# Altium schematic sheet Sheet2.SchDoc
size A
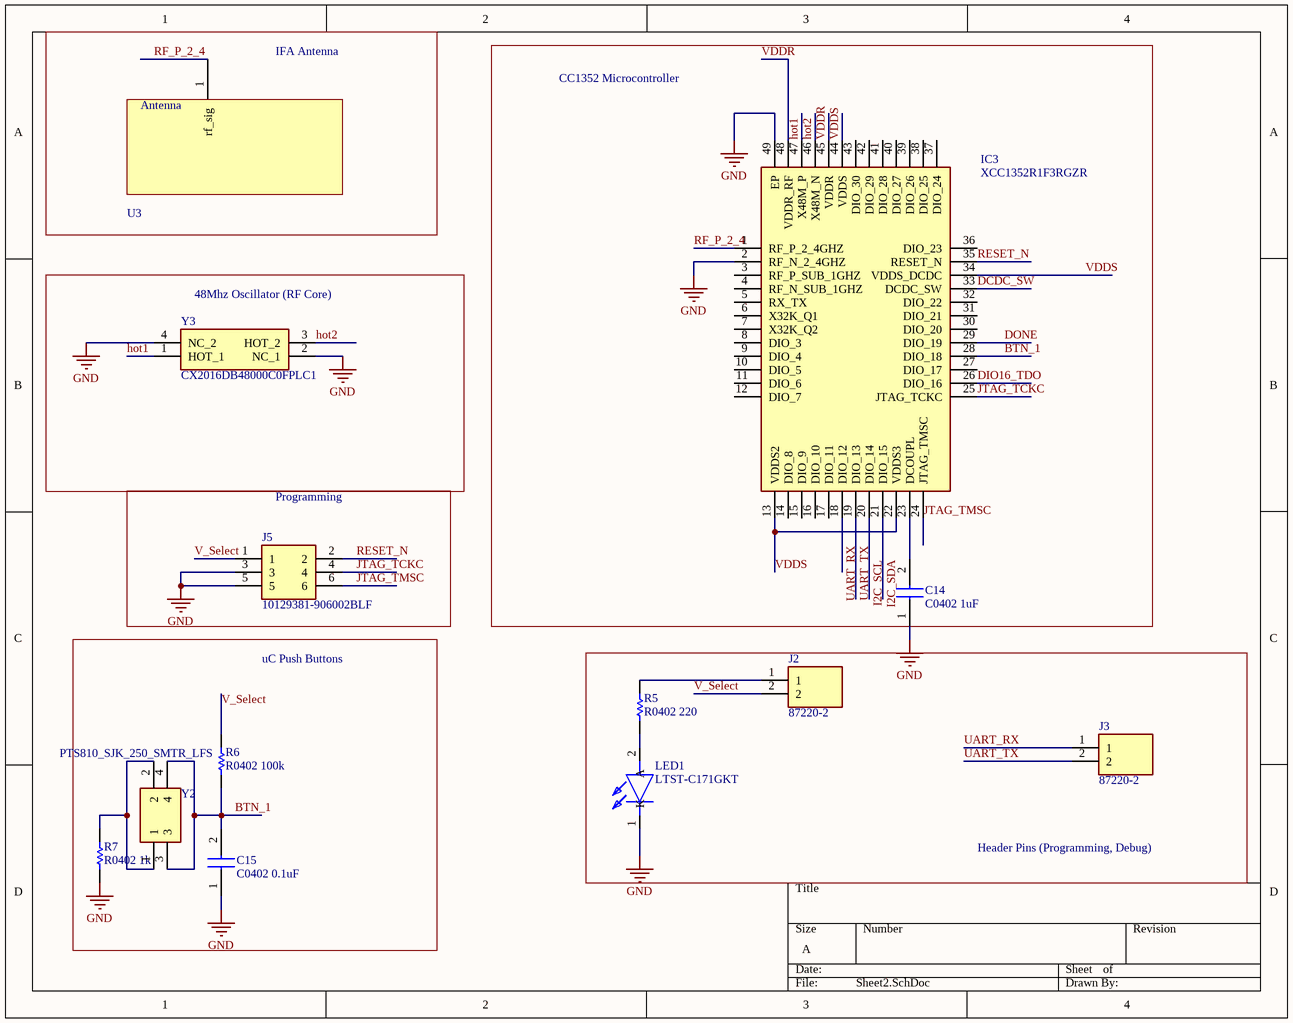
[diagram p0: Sheet2.SchDoc]

## Parts
C14  C0402 1uF  [CAPC0603X33N]
C15  C0402 0.1uF  [CAPC0603X33N]
IC3  XCC1352R1F3RGZR  [QFN50P700X700X100-49N-D]
J2  87220-2  [HDRV2W67P0X254_1X2_467X234X1083P]
J3  87220-2  [HDRV2W67P0X254_1X2_467X234X1083P]
J5  10129381-906002BLF  [HDRV6W67P254_2X3_762X483X858P]
LED1  LTST-C171GKT  [LEDC2012X90N]
R5  R0402 220  [RESC1005X40X25NL05T05]
R6  R0402 100k  [RESC1005X40X25NL05T05]
R7  R0402 1k  [RESC1005X40X25NL05T05]
U3  RF_ANTENNA_2  [RF_TRACE_ANTENNA_2]  (value not drawn)
Y2  PTS810_SJK_250_SMTR_LFS  [PTS810SJK250SMTRLFS]
Y3  CX2016DB48000C0FPLC1  [CX2016DB48000C0FPLC1]

## Blocks framed on the sheet
IFA Antenna: U3
CC1352 Microcontroller: C14 IC3
48Mhz Oscillator (RF Core): Y3
Programming: J5
uC Push Buttons: C15 R6 R7 Y2
Header Pins (Programming, Debug): J2 J3 LED1 R5

## Nets
GND: C14.1 C15.1 IC3.2(RF_N_2_4GHZ) IC3.49(EP) J5.3 J5.5 LED1.1(K) R7.1 Y3.2(NC_1) Y3.4(NC_2)
BTN_1: C15.2 IC3.28(DIO_18) R6.1 Y2.3 Y2.4
DCDC_SW: IC3.33(DCDC_SW)
DIO16_TDO: IC3.26(DIO_16)
DONE: IC3.29(DIO_19)
hot1: IC3.47(X48M_P) Y3.1(HOT_1)
hot2: IC3.46(X48M_N) Y3.3(HOT_2)
I2C_SCL: IC3.20(DIO_14)
I2C_SDA: IC3.21(DIO_15)
JTAG_TCKC: IC3.25(JTAG_TCKC) J5.4
JTAG_TMSC: IC3.24(JTAG_TMSC) J5.6
RESET_N: IC3.35(RESET_N) J5.2
RF_P_2_4: IC3.1(RF_P_2_4GHZ) U3.1(rf_sig)
UART_RX: IC3.18(DIO_12) J3.1
UART_TX: IC3.19(DIO_13) J3.2
V_Select: J2.2 J5.1 R6.2
VDDR: IC3.45(VDDR) IC3.48(VDDR_RF)
VDDS: IC3.13(VDDS2) IC3.22(VDDS3) IC3.34(VDDS_DCDC) IC3.44(VDDS)
NetC14_2: C14.2 IC3.23(DCOUPL)
NetJ2_1: J2.1 R5.2
NetLED1_2: LED1.2(A) R5.1
NetR7_2: R7.2 Y2.1 Y2.2

Not connected (* = marked no-connect by the designer): IC3 3(RF_P_SUB_1GHZ) 4(RF_N_SUB_1GHZ) 5(RX_TX) 6(X32K_Q1) 7(X32K_Q2) 8(DIO_3) 9(DIO_4) 10(DIO_5) 11(DIO_6) 12(DIO_7) 14(DIO_8) 15(DIO_9) 16(DIO_10) 17(DIO_11) 27(DIO_17) 30(DIO_20) 31(DIO_21) 32(DIO_22) 36(DIO_23) 37(DIO_24) 38(DIO_25) 39(DIO_26) 40(DIO_27) 41(DIO_28) 42(DIO_29) 43(DIO_30)

## Notes on the sheet
- (in symbol RF_ANTENNA_2) Antenna

## Library data of the parts
C14 C15 = 02014D474MAT2A: Capacitor; Manufacturer_Name: AVX; Datasheet Link: http://www.mouser.com/catalog/supplier/library/pdf/AVXSurfaceMountCeramic.pdf; Height: 0.33mm; Manufacturer_Part_Number: 02014D474MAT2A; Mouser Part Number: 581-02014D474MAT2A; Mouser Price/Stock: https://www.mouser.com/Search/Refine.aspx?Keyword=581-02014D474MAT2A
IC3 = XCC1352R1F3RGZR: Integrated Circuit; Manufacturer_Name: Texas Instruments; Datasheet Link: http://www.ti.com/lit/gpn/cc1352r; Height: 1mm; Manufacturer_Part_Number: XCC1352R1F3RGZR
J2 J3 = 87220-2: Connector; Manufacturer_Name: TE Connectivity; Allied_Number: 70082840; Datasheet Link: https://www.te.com/commerce/DocumentDelivery/DDEController?Action=showdoc&DocId=Customer+Drawing%7F87220%7FK3%7Fpdf%7FEnglish%7FENG_CD_87220_K3.pdf%7F87220-2; Height: 10.83mm; Manufacturer_Part_Number: 87220-2; Mouser Part Number: 571-872202; Mouser Price/Stock: https://www.mouser.com/Search/Refine.aspx?Keyword=571-872202; RS Part Number: 7202418P; RS Price/Stock: http://uk.rs-online.com/web/p/products/7202418P; Allied Price/Stock: https://www.alliedelec.com/teconnectivity-87220-2/70082840/
J5 = 10129381-906002BLF: Connector; Manufacturer_Name: Amphenol; Datasheet Link: https://componentsearchengine.com/Datasheets/1/10129381-906002BLF.pdf; Height: 8.58mm; Manufacturer_Part_Number: 10129381-906002BLF; Mouser Part Number: 649-1012938190602BLF; Mouser Price/Stock: https://www.mouser.com/Search/Refine.aspx?Keyword=649-1012938190602BLF
LED1 = LTST-C171GKT: LED; Manufacturer_Name: Lite-On; Datasheet Link: https://media.digikey.com/pdf/Data%20Sheets/Lite-On%20PDFs/LTST-C171GKT.pdf; Height: 0.9mm; Manufacturer_Part_Number: LTST-C171GKT; Mouser Part Number: 859-LTST-C171GKT; Mouser Price/Stock: https://www.mouser.com/Search/Refine.aspx?Keyword=859-LTST-C171GKT; RS Part Number: 6920935P; RS Price/Stock: http://uk.rs-online.com/web/p/products/6920935P
R5-R7 = CMP-2002-08135-1: Manufacturer: Vishay Dale; Part Number: CRCW040210K0FKED
Y2 = PTS810_SJK_250_SMTR_LFS: Crystal or Oscillator; Manufacturer_Name: C & K COMPONENTS; Manufacturer_Part_Number: PTS810 SJK 250 SMTR LFS; Datasheet Link: https://www.ckswitches.com/media/1476/pts810.pdf; Height: 2mm; Mouser Part Number: 611-PTS810SJK250SMTR; Mouser Price/Stock: https://www.mouser.com/Search/Refine.aspx?Keyword=611-PTS810SJK250SMTR
Y3 = CX2016DB48000C0FPLC1: Crystal or Oscillator; Manufacturer_Name: Kyocera Electronic Components; Datasheet Link: https://componentsearchengine.com/Datasheets/1/CX2016DB48000C0FPLC1.pdf; Manufacturer_Part_Number: CX2016DB48000C0FPLC1; Mouser Part Number: 581-CX2016DB48CFPLC1; Mouser Price/Stock: https://www.mouser.com/Search/Refine.aspx?Keyword=581-CX2016DB48CFPLC1